# Altium project Game_Consol.PrjPCB
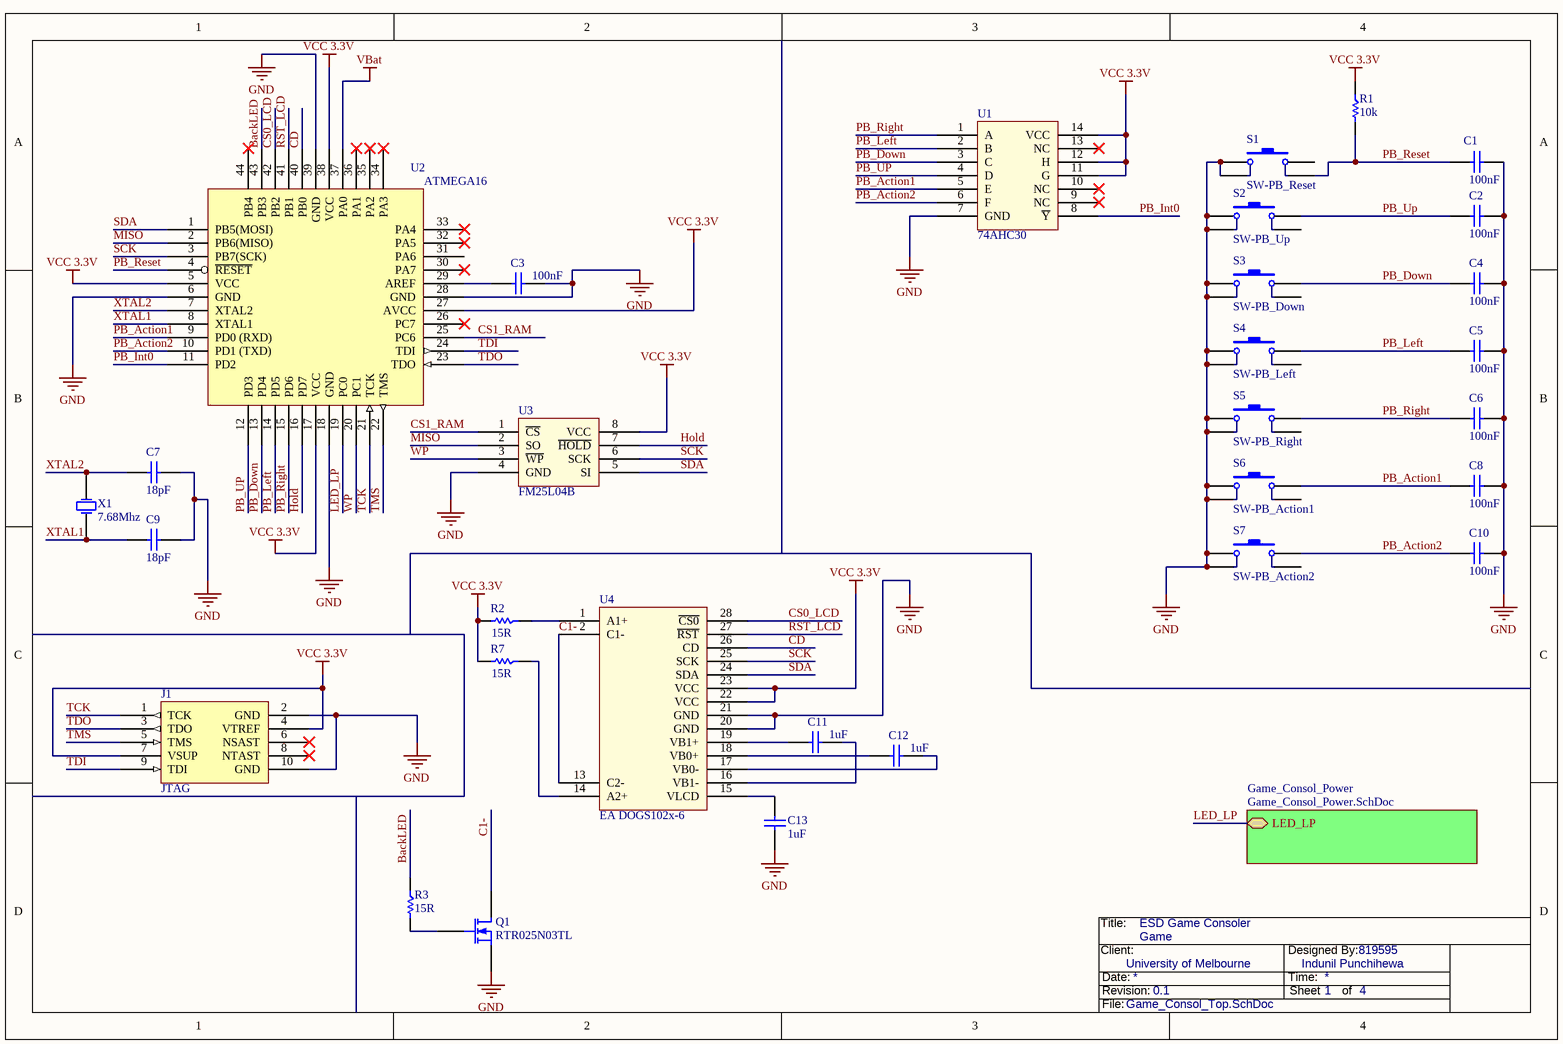
[diagram p0: Game_Consol_Top.SchDoc]

2 sheets, 54 parts. Net scope: hierarchical (ports join the sheet entries above them; power ports are global).
Board file: Game_Consol.PcbDoc
Sheets:
  Game_Consol_Top.SchDoc
    Game_Consol_Power = Game_Consol_Power.SchDoc

## Sheet Game_Consol_Top.SchDoc: Game
size A4; CompanyName: University of Melbourne; DrawnBy: 819595; Engineer: Indunil Punchihewa; Organization: University of Melbourne; DocumentNumber: 1; Revision: 0.1; SheetNumber: 1; SheetTotal: 4; Title_Project: ESD Game Consoler

### Parts
C1  100nF  [0805]
C2  100nF  [0805]
C3  100nF  [0805]
C4  100nF  [0805]
C5  100nF  [0805]
C6  100nF  [0805]
C7  18pF  [0805]
C8  100nF  [0805]
C9  18pF  [0805]
C10  100nF  [0805]
C11  1uF  [0805]
C12  1uF  [0805]
C13  1uF  [0805]
J1  JTAG  [BOXEDVERT10]
Q1  RTR025N03TL  [SOT23]
R1  10k  [0805]
R2  15R  [0805]
R3  15R  [0805]
R7  15R  [0805]
S1  SW-PB_Reset  [SPNO_SMD]
S2  SW-PB_Up  [SPNO_SMD]
S3  SW-PB_Down  [SPNO_SMD]
S4  SW-PB_Left  [SPNO_SMD]
S5  SW-PB_Right  [SPNO_SMD]
S6  SW-PB_Action1  [SPNO_SMD]
S7  SW-PB_Action2  [SPNO_SMD]
U1  74AHC30  [SOIC-14]
U2  ATMEGA16  [QFP-48]
U3  FM25L04B  [SOIC-8]
U4  EA DOGS102x-6  [EA DOGS102x]
X1  7.68Mhz  [XTAL_FLAT_SMD]

### Sub-sheets
Game_Consol_Power = Game_Consol_Power.SchDoc: LED_LP

### Nets
GND: C1.1 C2.1 C3.1 C4.1 C5.1 C6.1 C7.1 C8.1 C9.1 C10.1 C13.2 J1.2(GND) J1.10(GND) Q1.2 S1.1 S1.2 S2.1 S2.2 S3.1 S3.2 S4.1 S4.2 S5.1 S5.2 S6.1 S6.2 S7.1 S7.2 U1.7(GND) U2.6(GND) U2.18(GND) U2.28(GND) U2.39(GND) U3.4(GND) U4.20(GND) U4.21(GND)
VBat: U2.37(PA0)
VCC 3.3V: J1.4(VTREF) J1.7(VSUP) R1.1 R2.2 R7.2 U1.11(G) U1.12(H) U1.14(VCC) U2.5(VCC) U2.17(VCC) U2.27(AVCC) U2.38(VCC) U3.8(VCC) U4.22(VCC) U4.23(VCC)
BackLED: R3.1 U2.43(PB3)
C1-: Q1.3 U4.2(C1-) U4.13(C2-)
CD: U2.40(PB0) U4.26(CD)
CS0_LCD: U2.42(PB2) U4.28(~{CS0})
CS1_RAM: U2.25(PC6) U3.1(~{CS})
Hold: U2.16(PD7) U3.7(~{HOLD})
LED_LP: U2.19(PC0) ; sheet Game_Consol_Power/LED_LP
MISO: U2.2(PB6(MISO)) U3.2(SO)
PB_Action1: C8.2 S6.3 U1.5(E) U2.9(PD0_(RXD))
PB_Action2: C10.2 S7.3 U1.6(F) U2.10(PD1_(TXD))
PB_Down: C4.2 S3.3 U1.3(C) U2.13(PD4)
PB_Int0: U1.8(~{Y}) U2.11(PD2)
PB_Left: C5.2 S4.3 U1.2(B) U2.14(PD5)
PB_Reset: C1.2 R1.2 S1.4 U2.4(~{RESET})
PB_Right: C6.2 S5.3 U1.1(A) U2.15(PD6)
PB_UP: C2.2 S2.3 U1.4(D) U2.12(PD3)
RST_LCD: U2.41(PB1) U4.27(~{RST})
SCK: U2.3(PB7(SCK)) U3.6(SCK) U4.25(SCK)
SDA: U2.1(PB5(MOSI)) U3.5(SI) U4.24(SDA)
TCK: J1.1(TCK) U2.21(TCK)
TDI: J1.9(TDI) U2.24(TDI)
TDO: J1.3(TDO) U2.23(TDO)
TMS: J1.5(TMS) U2.22(TMS)
WP: U2.20(PC1) U3.3(~{WP})
XTAL1: C9.2 U2.8(XTAL1) X1.1(OSC1)
XTAL2: C7.2 U2.7(XTAL2) X1.2(OSC2)
NetC3_2: C3.2 U2.29(AREF)
NetC11_1: C11.1 U4.19(VB1+)
NetC11_2: C11.2 U4.16(VB1-)
NetC12_1: C12.1 U4.18(VB0+)
NetC12_2: C12.2 U4.17(VB0-)
NetC13_1: C13.1 U4.15(VLCD)
NetQ1_1: Q1.1 R3.2
NetR2_1: R2.1 U4.1(A1+)
NetR7_1: R7.1 U4.14(A2+)

Not connected (* = marked no-connect by the designer): J1 6(NSAST)* 8(NTAST)*; S1 3; S2 4; S3 4; S4 4; S5 4; S6 4; S7 4; U1 9(NC)* 10(NC)* 13(NC)*; U2 26(PC7)* 30(PA7)* 31(PA6) 32(PA5)* 33(PA4)* 34(PA3)* 35(PA2)* 36(PA1)* 44(PB4)*; U4 3 4 5 6 7 8 9 10 11 12

### Notes on the sheet
- Title:
- Client:
- Date:
- Revision:
- Time:
- Designed By:
- Sheet
- of
- File:

### Library data of the parts
C1-C13 = C 0805: Capacitor 100nF; Class I: Passive; Revision: July-2002: Re-released for DXP Platform.
  C1-C6 C8 C10: Value: 100nF
  C7 C9: Value: 18pF
  C11-C13: Value: 1uF
J1 = JTAG_CON: JTAG ATMEL connector
Q1 = MOSFET-N: N-Channel MOSFET; PackageDocument: 1995/1996; Published: 8-Jun-2000; LatestRevisionDate: 17-Jul-2002; LatestRevisionNote: Re-released for DXP Platform.; PackageReference: E3; Publisher: Altium Limited
R1-R3 R7 = R: Resistor
  R1: Value: 10k
  R2 R3 R7: Value: 15R
S1-S7 = SW-PB: Push Button Switch; Manufacturer: TE Connectivity; Manufacturer Part Number: FSM4JSMA; Circuit: SPST-NO; Switch Function: Off-Mom; Contact Rating @ Voltage: 0.05A @ 12VDC; Actuator Type: Standard; Actuator Orientation: Top Actuated; Outline: 6.00mm x 6.00mm; Illumination: Non-Illuminated; Operating Force: 160gf; Published: 24-Mar-1999; LatestRevisionDate: 17-Jul-2002; LatestRevisionNote: Re-released for DXP Platform.; PackageReference: SPST-2; Publisher: Altium Limited; PackageDescription: Switch; 2 Leads; Supplier 1: Digi-Key; RoHS: RoHS Compliant; Category: Switches; Stock 1: 30338; Pricing 1: 1=0.28, 10=0.265, 25=0.2256, 50=0.1974, 100=0.1834, 250=0.1622, 500=0.15516, 1000=0.12694, 5000=0.10579 (AUD); Mounting Type: Surface Mount; Termination Style: Gull Wing; Packaging: Bulk; ComponentLink1URL: http://documents.tycoelectronics.com/commerce/DocumentDelivery/DDEController?Action=srchrtrv&DocNm=2-1437565-7&DocType=CD&DocLang=EN; ComponentLink1Description: http://documents.tycoelectronics.com/commerce/DocumentDelivery/DDEController?Action=srchrtrv&DocNm=2-1437565-7&DocType=CD&DocLang=EN; Supplier Part Number 1: 450-1129-ND
U1 = 74AHC30: 1 x 8 Input NAND gate
U2 = ATMEGA16: ATMEGA16 Microcontroller
U3 = FM25L04B: FRAM 4Kb Memory
U4 = EA DOGS102x-6: LCD 102x64-pixel with backlight
X1 = XTAL: Crystal Oscillator; Revision: July-2002: Re-released for DXP Platform.; Digikey: 535-9103-1-ND

## Sheet Game_Consol_Power.SchDoc: Game_Consol_Power
size A4; CompanyName: University of Melbourne; DrawnBy: 819595; Engineer: Indunil Punchihewa; Organization: University of Melbourne; DocumentNumber: 1; Revision: 0.1; SheetNumber: 2; SheetTotal: 4; Title_Project: ESD Game Consoler
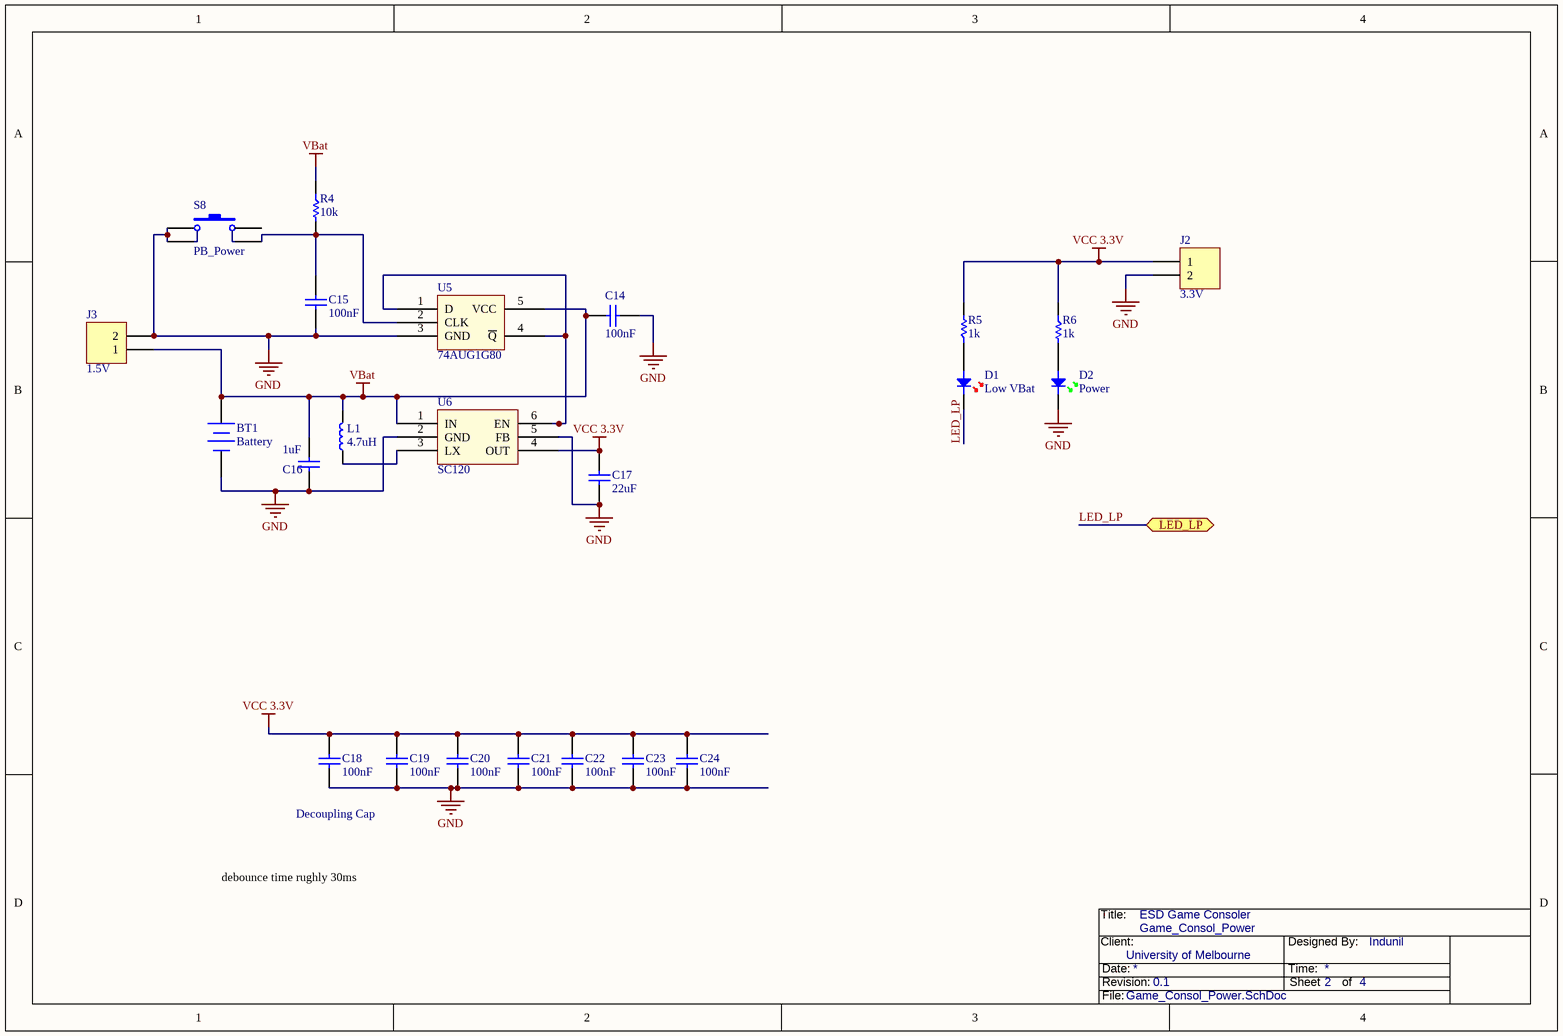
[diagram p1: Game_Consol_Power.SchDoc]

### Parts
BT1  Battery  [BATT_HOLDER]
C14  100nF  [0805]
C15  100nF  [0805]
C16  1uF  [0805]
C17  22uF  [1210]
C18  100nF  [0805]
C19  100nF  [0805]
C20  100nF  [0805]
C21  100nF  [0805]
C22  100nF  [0805]
C23  100nF  [0805]
C24  100nF  [0805]
D1  Low VBat  [0805D]
D2  Power  [0805D]
J2  3.3V  [HDR1X2]
J3  1.5V  [HDR1X2]
L1  4.7uH  [1210L]
R4  10k  [0805]
R5  1k  [0805]
R6  1k  [0805]
S8  PB_Power  [SPNO_SMD]
U5  74AUG1G80  [SOT23-5]
U6  SC120  [SOT23-6]

### Ports
LED_LP (bidir)

### Nets
GND: BT1.2(-) C14.1 C15.2 C16.2 C17.2 C18.2 C19.2 C20.2 C21.2 C22.2 C23.2 C24.2 D2.K J2.2 J3.2 S8.1 S8.2 U5.3(GND) U6.2(GND) U6.5(FB)
VBat: BT1.1(+) C14.2 C16.1 J3.1 L1.2 R4.1 U5.5(VCC) U6.1(IN)
VCC 3.3V: C17.1 C18.1 C19.1 C20.1 C21.1 C22.1 C23.1 C24.1 J2.1 R5.2 R6.1 U6.4(OUT)
LED_LP: D1.K ; port LED_LP
NetC15_1: C15.1 R4.2 S8.4 U5.2(CLK)
NetD1_A: D1.A R5.1
NetD2_A: D2.A R6.2
NetL1_1: L1.1 U6.3(LX)
NetU5_1: U5.1(D) U5.4(~{Q}) U6.6(EN)

Not connected (* = marked no-connect by the designer): S8 3

### Notes on the sheet
- Decoupling Cap
- debounce time rughly 30ms
- Title:
- Client:
- Date:
- Revision:
- Time:
- Designed By:
- Sheet
- of
- Indunil
- File:

### Library data of the parts
BT1 = Battery: Multicell Battery; Published: 24-Mar-1999; LatestRevisionDate: 17-Jul-2002; LatestRevisionNote: Re-released for DXP Platform.; PackageReference: BAT-2; Publisher: Altium Limited; PackageDescription: Battery; 2 Leads
C14-C16 C18-C24 = C 0805: Capacitor 100nF; Class I: Passive; Revision: July-2002: Re-released for DXP Platform.
  C14 C15 C18-C24: Value: 100nF
  C16: Value: 1uF
C17 = C 1210: Capacitor 22uF; Manufacturer: Generic Components; Manufacturer Part Number: LMK316F226ZL-T; Class I: Passive; Capacitance: 22µF; Voltage - Rated: 10V; Tolerance: -20%, +80%; Temperature Coefficient: Y5V (F); Published: 8-Jun-2000; Revision: July-2002: Re-released for DXP Platform.; Publisher: Altium Limited; Class II: Capacitor; Supplier 1: Digi-Key; RoHS: RoHS Compliant; Category: Capacitors; Stock 1: 33004; Pricing 1: 1=0.3, 10=0.254, 50=0.143, 100=0.1271, 250=0.09532, 500=0.08418, 1000=0.07465 (AUD); Mounting Type: Surface Mount, MLCC; Operating Temperature: -30°C ~ 85°C; Applications: General Purpose; Ratings: -; Package / Case: 1206 (3216 Metric); Size / Dimension: 0.126" L x 0.063" W (3.20mm x 1.60mm); Height - Seated (Max): -; Thickness (Max): 0.071" (1.80mm); Lead Spacing: -; Features: -; Packaging: Cut Tape (CT); Lead Style: -; ComponentLink1URL: http://www.yuden.co.jp/or/product/category/capacitor/LMK316F226ZL-T.pdf; ComponentLink1Description: http://www.yuden.co.jp/or/product/category/capacitor/LMK316F226ZL-T.pdf; Supplier Part Number 1: 587-1356-1-ND; Value: 22uF
D1 = LED RED: Light Emitting Diode; Manufacturer: Generic Components; Class I: Discrete; Class II: Diode - Switching; Published: 8-Jun-2000; Revision: July-2002: Re-released for DXP Platform.; Publisher: Altium Limited
D2 = LED GREEN: Light Emitting Diode; Manufacturer: Generic Components; Class I: Discrete; Class II: Diode - Switching; Published: 8-Jun-2000; Revision: July-2002: Re-released for DXP Platform.; Publisher: Altium Limited
J2 J3 = HDR2: 2 Pin Header; LatestRevisionDate: 17-Jul-2002; LatestRevisionNote: Re-released for DXP Platform.; Publisher: Altium Limited
L1 = I 1210: Inductor 4.7uH; Manufacturer: Murata Electronics North America; Manufacturer Part Number: LQH32CN4R7M23L; Code_IEC: 1005; Inductance: 4.7µH; Current: 450mA; Type: Ferrite Core; Tolerance: ±20%; Shielding: Unshielded; DC Resistance (DCR): 260 mOhm Max; Frequency - Self Resonant: 43MHz; Material - Core: Ferrite; Frequency - Test: 1MHz; Published: 8-Jun-2000; LatestRevisionDate: 17-Jul-2002; LatestRevisionNote: Re-released for DXP Platform.; PackageReference: 0402-A; Publisher: Altium Limited; Code_JEITA: 0402; Class II: Inductor; Supplier 1: Digi-Key; RoHS: RoHS Compliant; Category: Inductors, Coils, Chokes; Stock 1: 31057; Pricing 1: 1=0.34, 10=0.313, 25=0.2784, 50=0.2436, 100=0.2261, 250=0.20868, 500=0.19824, 750=0.18084, 1000=0.15998 (AUD); Current - Saturation: -; Current - Temperature Rise: -; Q @ Freq: -; Applications: Power Supplies; Package / Case: 1210 (3225 Metric); Mounting Type: Surface Mount; Packaging: Cut Tape (CT); Operating Temperature: -40°C ~ 85°C; ComponentLink1URL: http://search.murata.co.jp/Ceramy/image/img/PDF/ENG/L0075S0093LQH32C_23~33.pdf; ComponentLink1Description: http://search.murata.co.jp/Ceramy/image/img/PDF/ENG/L0075S0093LQH32C_23~33.pdf; Supplier Part Number 1: 490-2495-1-ND; Value: 4.7uH
R4-R6 = R: Resistor
  R4: Value: 10k
  R5 R6: Value: 1k
S8 = SW-PB: as S1 on sheet Game_Consol_Top; Published: 24-Mar-1999; LatestRevisionDate: 17-Jul-2002; LatestRevisionNote: Re-released for DXP Platform.; PackageReference: SPST-2; Publisher: Altium Limited; PackageDescription: Switch; 2 Leads; Supplier 1: Digi-Key; RoHS: RoHS Compliant; Category: Switches; Stock 1: 30338; Pricing 1: 1=0.28, 10=0.265, 25=0.2256, 50=0.1974, 100=0.1834, 250=0.1622, 500=0.15516, 1000=0.12694, 5000=0.10579 (AUD); Mounting Type: Surface Mount; Termination Style: Gull Wing; Packaging: Bulk; ComponentLink1URL: http://documents.tycoelectronics.com/commerce/DocumentDelivery/DDEController?Action=srchrtrv&DocNm=2-1437565-7&DocType=CD&DocLang=EN; ComponentLink1Description: http://documents.tycoelectronics.com/commerce/DocumentDelivery/DDEController?Action=srchrtrv&DocNm=2-1437565-7&DocType=CD&DocLang=EN; Supplier Part Number 1: 450-1129-ND
U5 = 74AUG1G80: Inverted single D flip flop
U6 = SC120: Regulator Low Voltage

## Nets that join several sheets
GND: Game_Consol_Top (36 pins), Game_Consol_Power (20 pins)
VBat: Game_Consol_Top (U2.37), Game_Consol_Power (8 pins)
VCC 3.3V: Game_Consol_Top (15 pins), Game_Consol_Power (12 pins)
LED_LP: Game_Consol_Top (U2.19), Game_Consol_Power (D1.K)